# Altium project mV_Meter.PrjPcb (part 2 of 2)

## Sheet DISP_KEYB.SchDoc: Title
size 420 x 297 mm; Author: G.Kasprowicz; CompanyName: WUT ISE; DrawnBy: G.Kasprowicz; Organization: WUT ISE; Address1: PW ISE; Address2: Nowowiejska 15/19 00-665 Warsaw; Address3: gkasprow@gmail.com; Revision: 2; SheetNumber: 4; SheetTotal: 5; ModifiedBy: -; CheckedDate: -; Title2: Title 2; DivGrp: WUT ISE; Designer: G.Kasprowicz; ModifiedDate: -; ProjectName: Sensor Box
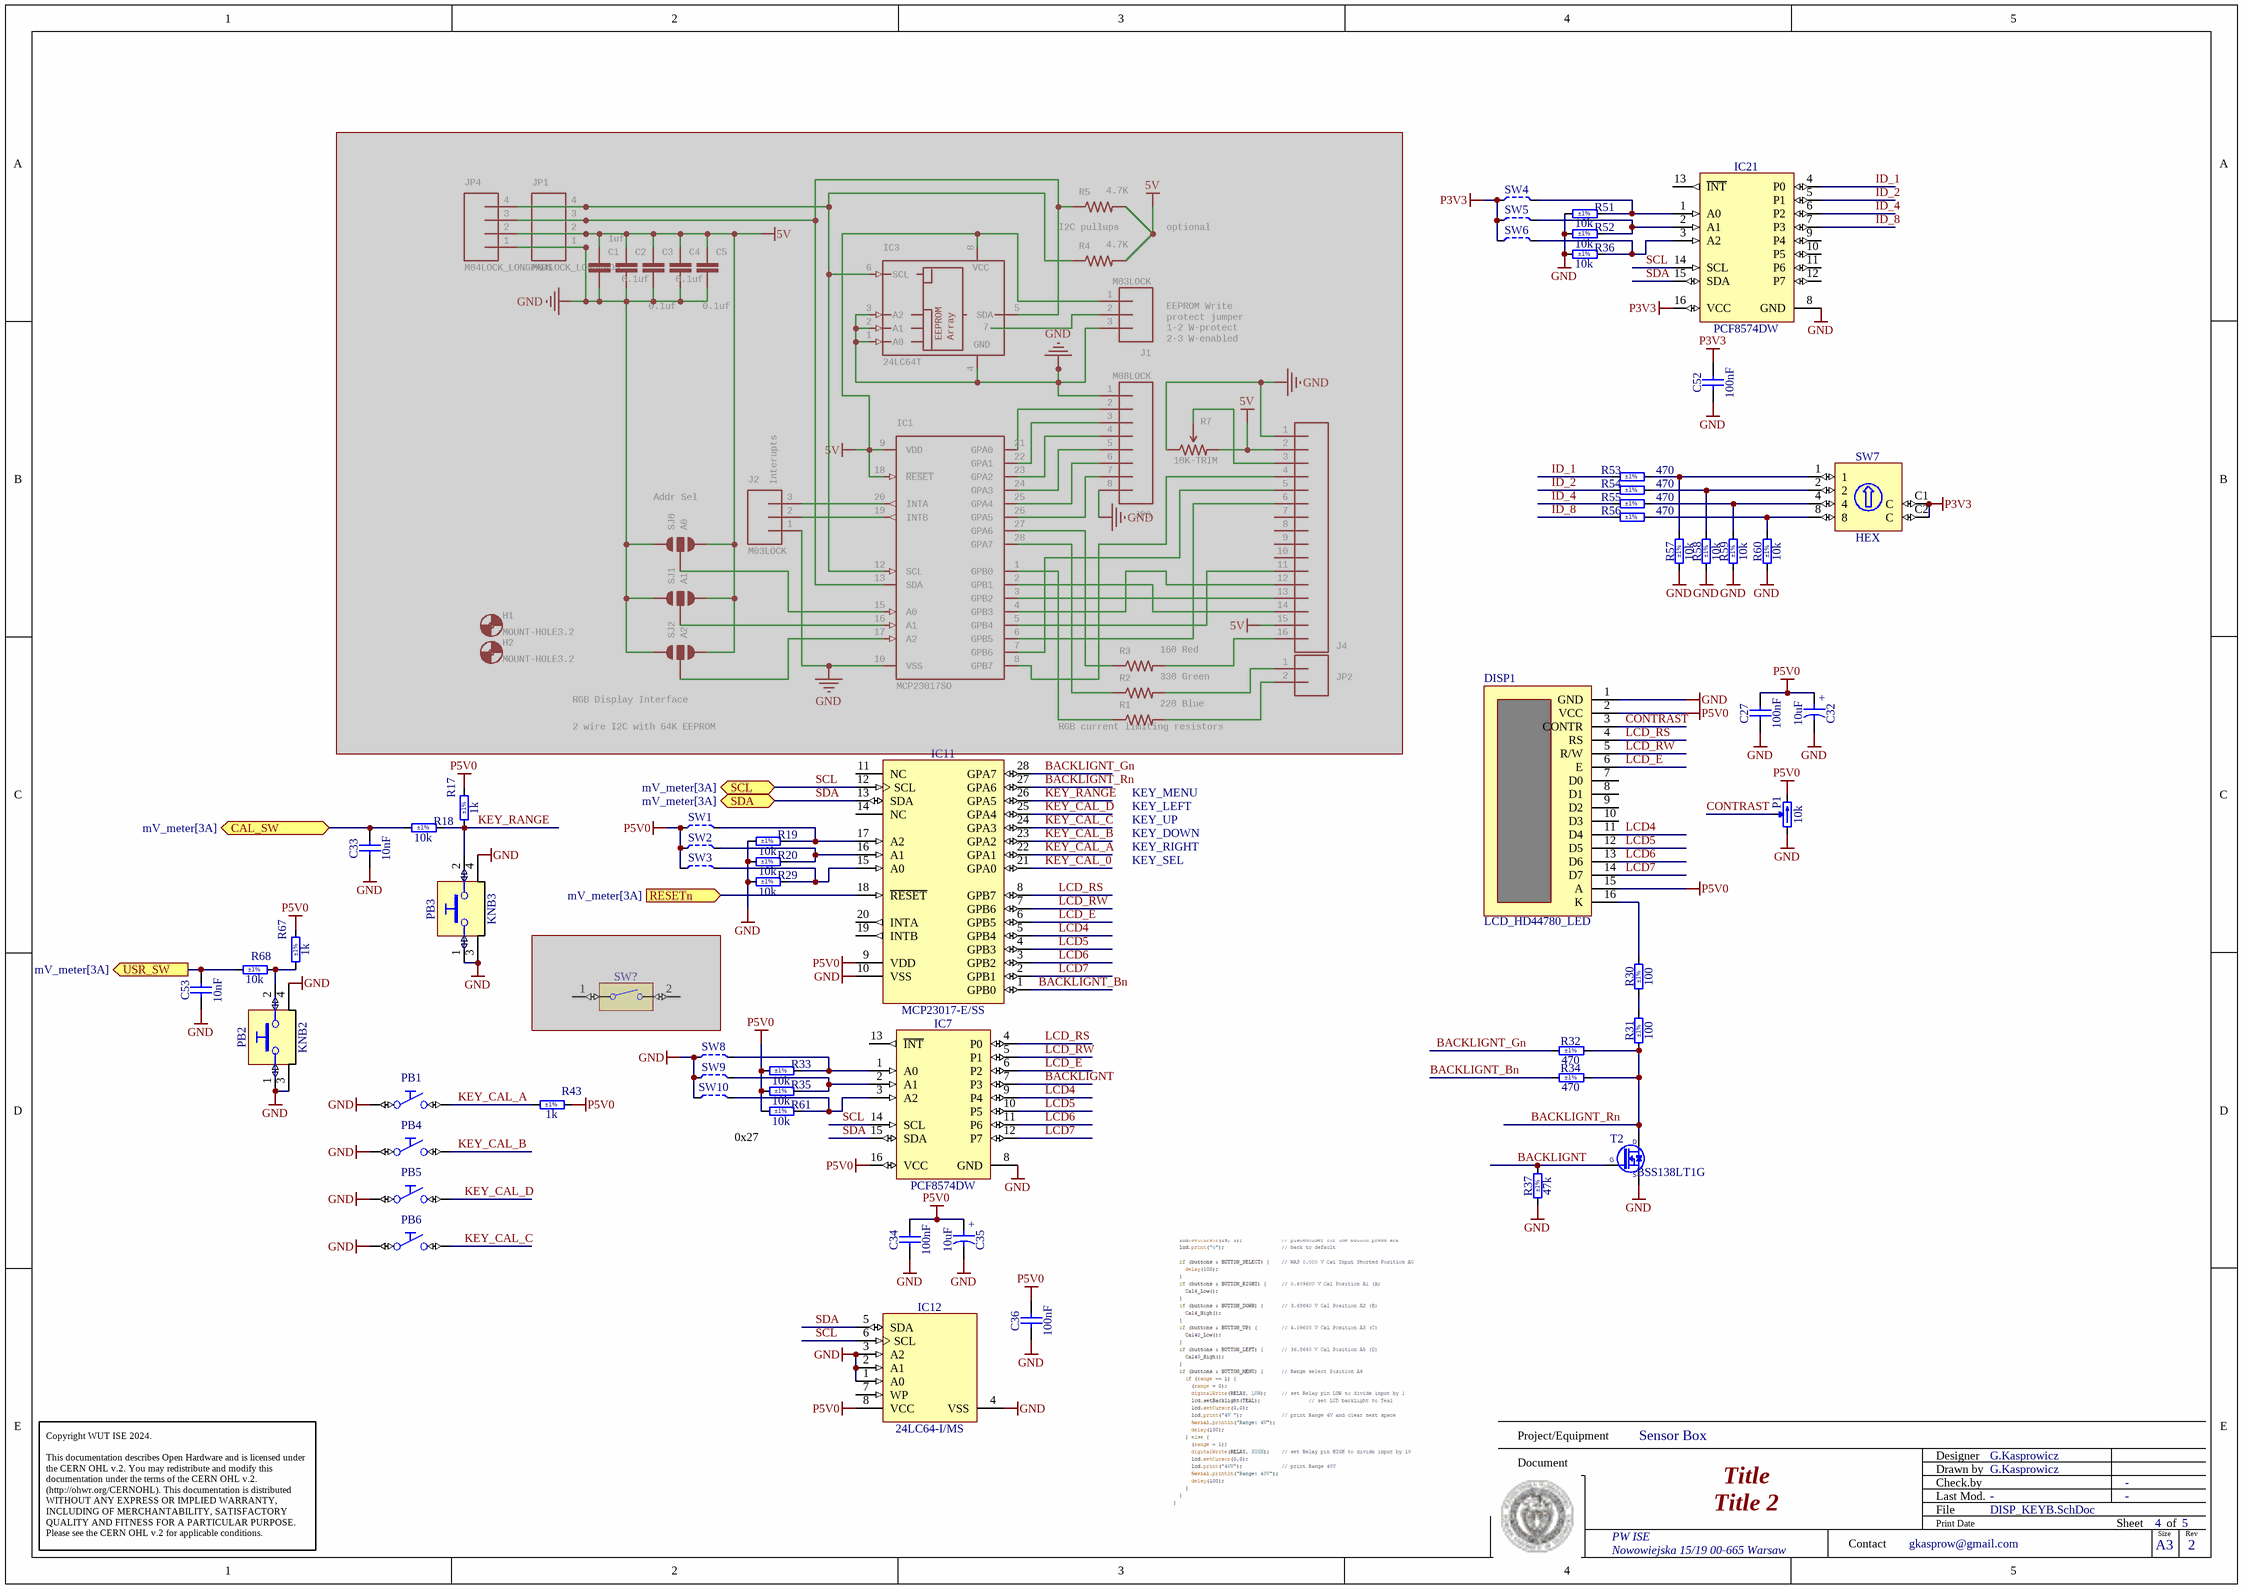
[diagram p3: DISP_KEYB.SchDoc]

### Parts
(Parts that share a designator on the sheet are numbered #1, #2 ... from top to bottom, then left to right.)
C1#1  1uf  [CAP-PTH-SMALLEZ]  (masked out: inside a compile mask, not in the netlist)
C2#1  0.1uf  [CAP-PTH-SMALLEZ]  (masked out: inside a compile mask, not in the netlist)
C3#1  0.1uf  [CAP-PTH-SMALLEZ]  (masked out: inside a compile mask, not in the netlist)
C4#1  0.1uf  [CAP-PTH-SMALLEZ]  (masked out: inside a compile mask, not in the netlist)
C5#1  0.1uf  [CAP-PTH-SMALLEZ]  (masked out: inside a compile mask, not in the netlist)
C27  100nF  [CAPC2012X88N]
C32  10uF  [CAPMP3216X180N]
C33  10nF  [CAPC1608X87N]
C34  100nF  [CAPC2012X88N]
C35  10uF  [CAPMP3216X180N]
C36  100nF  [CAPC2012X88N]
C52  100nF  [CAPC2012X88N]
C53  10nF  [CAPC1608X87N]
DISP1  LCD_HD44780_LED  [IDC_16_male]
H1  MOUNT-HOLE3.2  [3,2]  (masked out: inside a compile mask, not in the netlist)
H2  MOUNT-HOLE3.2  [3,2]  (masked out: inside a compile mask, not in the netlist)
IC1#1  MCP23017SO  [SO28W]  (masked out: inside a compile mask, not in the netlist)
IC3#2  24LC64T  [SO-08M]  (masked out: inside a compile mask, not in the netlist)
IC7  PCF8574DW  [SOIC127P1030X265-16N]
IC11  MCP23017-E/SS  [SOP65P780X200-28N]
IC12  24LC64-I/MS  [SOP65P490X110-8N]
IC21  PCF8574DW  [SOIC127P1030X265-16N]
J1#1  M03LOCK  [1X03_LOCK]  (masked out: inside a compile mask, not in the netlist)
J2#2  M03LOCK  [1X03_LOCK]  (masked out: inside a compile mask, not in the netlist)
J4#2  M16LOCK  [1X16_LOCK]  (value not drawn)  (masked out: inside a compile mask, not in the netlist)
JP1  M04LOCK_LONGPADS  [1X04_LOCK_LONGPADS]  (masked out: inside a compile mask, not in the netlist)
JP2  M02PTH  [1X02]  (value not drawn)  (masked out: inside a compile mask, not in the netlist)
JP3  M08LOCK  [1X08_LOCK]  (masked out: inside a compile mask, not in the netlist)
JP4  M04LOCK_LONGPADS  [1X04_LOCK_LONGPADS]  (masked out: inside a compile mask, not in the netlist)
KNB2  Knob  [KNB_OMRON_B32-2010_H]  (value not drawn)
KNB3  Knob  [KNB_OMRON_B32-2010_H]  (value not drawn)
P1  10k  [TRIM_BOURNS_3314G-1]
PB1  Push Button  [PB_C&K_KSS221GLFS]  (value not drawn)
PB2  Push Button  [PB_OMRON_B3F-3150]  (value not drawn)
PB3  Push Button  [PB_OMRON_B3F-3150]  (value not drawn)
PB4  Push Button  [PB_C&K_KSS221GLFS]  (value not drawn)
PB5  Push Button  [PB_C&K_KSS221GLFS]  (value not drawn)
PB6  Push Button  [PB_C&K_KSS221GLFS]  (value not drawn)
R1#1  220 Blue  [AXIAL-0.4]  (masked out: inside a compile mask, not in the netlist)
R2#1  330 Green  [AXIAL-0.4]  (masked out: inside a compile mask, not in the netlist)
R3#1  160 Red  [AXIAL-0.4]  (masked out: inside a compile mask, not in the netlist)
R4#1  4.7K  [AXIAL-0.3-KIT]  (masked out: inside a compile mask, not in the netlist)
R5#1  4.7K  [AXIAL-0.3-KIT]  (masked out: inside a compile mask, not in the netlist)
R7#2  10K-TRIM  [TRIMPOT_TC33]  (masked out: inside a compile mask, not in the netlist)
R17  1k  Tolerance: ±1%  [RESC1608X55N]
R18  10k  Tolerance: ±1%  [RESC1608X55N]
R19  10k  Tolerance: ±1%  [RESC1608X55N]
R20  10k  Tolerance: ±1%  [RESC1608X55N]
R29  10k  Tolerance: ±1%  [RESC1608X55N]
R30  100  Tolerance: ±1%  [RESC1608X55N]
R31  100  Tolerance: ±1%  [RESC1608X55N]
R32  470  Tolerance: ±1%  [RESC1608X55N]
R33  10k  Tolerance: ±1%  [RESC1608X55N]
R34  470  Tolerance: ±1%  [RESC1608X55N]
R35  10k  Tolerance: ±1%  [RESC1608X55N]
R36  10k  Tolerance: ±1%  [RESC1608X55N]
R37  47k  Tolerance: ±1%  [RESC1608X55N]
R43  1k  Tolerance: ±1%  [RESC1608X55N]
R51  10k  Tolerance: ±1%  [RESC1608X55N]
R52  10k  Tolerance: ±1%  [RESC1608X55N]
R53  470  Tolerance: ±1%  [RESC1608X55N]
R54  470  Tolerance: ±1%  [RESC1608X55N]
R55  470  Tolerance: ±1%  [RESC1608X55N]
R56  470  Tolerance: ±1%  [RESC1608X55N]
R57  10k  Tolerance: ±1%  [RESC1608X55N]
R58  10k  Tolerance: ±1%  [RESC1608X55N]
R59  10k  Tolerance: ±1%  [RESC1608X55N]
R60  10k  Tolerance: ±1%  [RESC1608X55N]
R61  10k  Tolerance: ±1%  [RESC1608X55N]
R67  1k  Tolerance: ±1%  [RESC1608X55N]
R68  10k  Tolerance: ±1%  [RESC1608X55N]
SJ0  A0  [SJ_3_PASTE2&3]  (masked out: inside a compile mask, not in the netlist)
SJ1  A1  [SJ_3_PASTE2&3]  (masked out: inside a compile mask, not in the netlist)
SJ2  A2  [SJ_3_PASTE2&3]  (masked out: inside a compile mask, not in the netlist)
SW1  Switch  [JUMPSMD0805_G50]  (value not drawn)  (no BOM)
SW2  Switch  [JUMPSMD0805_G50]  (value not drawn)  (no BOM)
SW3  Switch  [JUMPSMD0805_G50]  (value not drawn)  (no BOM)
SW4  Switch  [JUMPSMD0805_G50]  (value not drawn)  (no BOM)
SW5  Switch  [JUMPSMD0805_G50]  (value not drawn)  (no BOM)
SW6  Switch  [JUMPSMD0805_G50]  (value not drawn)  (no BOM)
SW7  HEX  [SW_APEM_PT65106L254]
SW8  Switch  [JUMPSMD0805_G50]  (value not drawn)  (no BOM)
SW9  Switch  [JUMPSMD0805_G50]  (value not drawn)  (no BOM)
SW10  Switch  [JUMPSMD0805_G50]  (value not drawn)  (no BOM)
SW?  Switch  [SW_OMRON_B3U-3000PM]  (value not drawn)  (masked out: inside a compile mask, not in the netlist)
T2  BSS138LT1G  [SOT95P240X110-3N]

### Ports
CAL_SW (bidir, see mV_meter[3A]), RESETn (in, see mV_meter[3A]), SCL (bidir, see mV_meter[3A]), SDA (bidir, see mV_meter[3A]), USR_SW (out, see mV_meter[3A])

### Nets
GND: C27.1 C32.2 C33.1 C34.1 C35.2 C36.1 C52.1 C53.1 DISP1.1(GND) IC7.8(GND) IC11.10(VSS) IC12.1(A0) IC12.2(A1) IC12.3(A2) IC12.4(VSS) IC21.8(GND) P1.1(CCW) PB1.1(C) PB2.1 PB2.3 PB2.4 PB3.1 PB3.3 PB3.4 PB4.1(C) PB5.1(C) PB6.1(C) R19.1 R20.1 R29.1 R36.1 R37.1 R51.1 R52.1 R57.1 R58.1 R59.1 R60.1 SW8.1 SW9.1 SW10.1 T2.2(S)
P3V3: C52.2 IC21.16(VCC) SW4.1 SW5.1 SW6.1 SW7.C1(C) SW7.C2(C)
P5V0: C27.2 C32.1 C34.2 C35.1 C36.2 DISP1.2(VCC) DISP1.15(A) IC7.16(VCC) IC11.9(VDD) IC12.8(VCC) P1.3(CW) R17.2 R33.1 R35.1 R43.2 R61.1 R67.2 SW1.1 SW2.1 SW3.1
BACKLIGNT: IC7.7(P3) R37.2 T2.1(G)
BACKLIGNT_Bn: IC11.1(GPB0) R34.1
BACKLIGNT_Gn: IC11.28(GPA7) R32.1
BACKLIGNT_Rn: IC11.27(GPA6) R31.1 R32.2 R34.2 T2.3(D)
CAL_SW: C33.2 R18.1 ; port CAL_SW
CONTRAST: DISP1.3(CONTR) P1.2(W)
ID_1: IC21.4(P0) R53.1
ID_2: IC21.5(P1) R54.1
ID_4: IC21.6(P2) R55.1
ID_8: IC21.7(P3) R56.1
KEY_CAL_0: IC11.21(GPA0)
KEY_CAL_A: IC11.22(GPA1) PB1.2(NO) R43.1
KEY_CAL_B: IC11.23(GPA2) PB4.2(NO)
KEY_CAL_C: IC11.24(GPA3) PB6.2(NO)
KEY_CAL_D: IC11.25(GPA4) PB5.2(NO)
KEY_RANGE: IC11.26(GPA5) PB3.2 R17.1 R18.2
LCD4: DISP1.11(D4) IC7.9(P4) IC11.5(GPB4)
LCD5: DISP1.12(D5) IC7.10(P5) IC11.4(GPB3)
LCD6: DISP1.13(D6) IC7.11(P6) IC11.3(GPB2)
LCD7: DISP1.14(D7) IC7.12(P7) IC11.2(GPB1)
LCD_E: DISP1.6(E) IC7.6(P2) IC11.6(GPB5)
LCD_RS: DISP1.4(RS) IC7.4(P0) IC11.8(GPB7)
LCD_RW: DISP1.5(R/W) IC7.5(P1) IC11.7(GPB6)
RESETn: IC11.18(~{RESET}) ; port RESETn
SCL: IC7.14(SCL) IC11.12(SCL) IC12.6(SCL) IC21.14(SCL) ; port SCL
SDA: IC7.15(SDA) IC11.13(SDA) IC12.5(SDA) IC21.15(SDA) ; port SDA
USR_SW: C53.2 R68.1 ; port USR_SW
NetDISP1_16: DISP1.16(K) R30.2
NetIC7_1: IC7.1(A0) R33.2 SW8.2
NetIC7_2: IC7.2(A1) R35.2 SW9.2
NetIC7_3: IC7.3(A2) R61.2 SW10.2
NetIC11_15: IC11.15(A0) R29.2 SW3.2
NetIC11_16: IC11.16(A1) R20.2 SW2.2
NetIC11_17: IC11.17(A2) R19.2 SW1.2
NetIC21_1: IC21.1(A0) R51.2 SW4.2
NetIC21_2: IC21.2(A1) R52.2 SW5.2
NetIC21_3: IC21.3(A2) R36.2 SW6.2
NetPB2_2: PB2.2 R67.1 R68.2
NetR30_1: R30.1 R31.2
NetR53_2: R53.2 R57.2 SW7.1
NetR54_2: R54.2 R58.2 SW7.2
NetR55_2: R55.2 R59.2 SW7.4
NetR56_2: R56.2 R60.2 SW7.8

Not connected (* = marked no-connect by the designer): DISP1 7(D0) 8(D1) 9(D2) 10(D3); IC7 13(~{INT}); IC11 11(NC) 14(NC) 19(INTB) 20(INTA); IC12 7(WP); IC21 9(P4) 10(P5) 11(P6) 12(P7) 13(~{INT})

### Notes on the sheet
- I2C pullups
- optional
- (near IC3#2) 7
- (near J1#1) EEPROM Write
  protect jumper
  1-2 W-protect
  2-3 W-enabled
- (near SJ0) Addr Sel
- (near J2#2) Interupts
- (near SJ2) RGB Display Interface
- 2 wire I2C with 64K EEPROM
- (near R1#1) RGB current limiting resistors
- KEY_MENU
- KEY_LEFT
- KEY_UP
- KEY_DOWN
- KEY_RIGHT
- KEY_SEL
- 0x27
- Project/Equipment
- Document
- Designer
- Drawn by
- Check.by
- Copyright WUT ISE 2024.
  This documentation describes Open Hardware and is licensed under the CERN OHL v.2. You may redistribute and modify this documentation under the terms of the CERN OHL v.2. (http://ohwr.org/CERNOHL). This documentation is distributed WITHOUT ANY EXPRESS OR IMPLIED WARRANTY, INCLUDING OF MERCHANTABILITY, SATISFACTORY QUALITY AND FITNESS FOR A PARTICULAR PURPOSE. Please see the CERN OHL v.2 for applicable conditions.
- Contact
- File
- Last Mod.
- Print Date
- Sheet
- Size
- A3
- of
- Rev
- (in symbol CTE3216-18_10UF_10V_10%_LESR1800) +

### Library data of the parts
C1#1 C2#1 C3#1 C4#1 C5#1 = CAPEZ: CapacitorStandard 0603 ceramic capacitor, and 0.1" leaded capacitor.; GateName_1: G$1; SymbolName_1: CAP; DeviceName: EZ; LibraryName: SparkFun-Capacitors; DeviceSetName: CAP
C27 C34 C36 C52 = CC0805_100NF_50V_1%_NP0: Non-polarised capacitor; Part Description: SMD Multilayer Chip Ceramic Capacitor; Manufacturer: GENERIC; Manufacturer1 Part Number: 0805N103F500C; Voltage: 50V; TC: C0G/NP0; Tolerance: ±1%; Part Number: CC0805_100NF_50V_1%_NP0; Component Kind: Standard; Component Type: Standard; Footprint: CAPC2012X135N; Pin Count: 2; Value: 100nF; Status: Not Recommended; Manufacturer Part Number: CC0805_100NF_50V_1%_NP0; Case: 0805; Mounted: Yes; Socket: No; SMD: Yes; Sense: No; ComponentHeight: 1.35mm; Manufacturer1 Example: WALSIN TECHNOLOGY CORPORATION; Manufacturer1 ComponentHeight: 1.35mm; HelpURL: \\cern.ch\dfs\Applications\Altium\Datasheets\CC0805_WALSIN_0805.pdf; Author: CERN DEM HF; CreateDate: 28.08.2023; LatestRevisionDate: 28.08.2023
C32 C35 = CTE3216-18_10UF_10V_10%_LESR1800: Polarised capacitor; Part Description: Low ESR 1R8 Solid Tantalum Chip Capacitor; Manufacturer: GENERIC; Manufacturer1 Part Number: TPSA106K010R1800; Voltage: 10V; Tolerance: ±10%; Part Number: CTE3216-18_10UF_10V_10%_LESR1800; Component Kind: Standard; Component Type: Standard; Pin Count: 2; Value: 10uF; Status: Preferred; Manufacturer Part Number: CTE3216-18_10UF_10V_10%_LESR1800; Case: A; Mounted: Yes; Socket: No; SMD: Yes; Sense: No; Manufacturer1 Example: AVX; Manufacturer1 ComponentHeight: 1.8mm; HelpURL: \\cern.ch\dfs\Applications\Altium\Datasheets\CTE-LESR_AVX_TPS.pdf; Author: CERN DEM JLC; CreateDate: 05.05.2008; LatestRevisionDate: 20.01.2009
C33 C53 = CC0603_10NF_50V_5%_C0G: Non-polarised capacitor; Part Description: SMD Multilayer Chip Ceramic Capacitor; Manufacturer: GENERIC; Manufacturer1 Part Number: C1608C0G1H103J080; Voltage: 50V; TC: C0G/NP0; Tolerance: ±5%; Part Number: CC0603_10NF_50V_5%_C0G; Component Kind: Standard; Component Type: Standard; Pin Count: 2; Value: 10nF; Status: Preferred; Manufacturer Part Number: CC0603_10NF_50V_5%_C0G; Case: 0603; Mounted: Yes; Socket: No; SMD: Yes; Sense: No; Manufacturer1 Example: TDK; Manufacturer1 ComponentHeight: 0.9mm; HelpURL: \\cern.ch\dfs\Applications\Altium\Datasheets\CC0603_C0G_TDK_C.pdf; Author: CERN DEM JLC; CreateDate: 10.12.2014; LatestRevisionDate: 10.12.2014
DISP1 = LCD_HD44780_LED: LCD character display socket with backlight
H1 H2 = MOUNT-HOLE3.2: MOUNTING HOLE with drill center marker; GateName_1: G$1; DeviceName: 3.2; SymbolName_1: MOUNT-HOLE; LibraryName: holes; DeviceSetName: MOUNT-HOLE
IC1#1 = MCP23017SO: http://ww1.microchip.com/downloads/en/DeviceDoc/21952a.pdf   Source: http://ww1.microchip.com/downloads/en/DeviceDoc/21952a.pdf; GateName_1: G$1; DeviceName: SO; SymbolName_1: MCP23017; LibraryName: adafruit; DeviceSetName: MCP23017
IC3#2 = 24-*SM: Serial EEPROM   32 K/64 K, 1.8 V, I2C; MPN: 24LC65/SM; GateName_1: G$1; SymbolName_1: 24AA32; DeviceName: SM; DeviceSetName: 24-*; MF: MICROCHIP; LibraryName: microchip; Array: Array; VCC: VCC; GND: GND; EEPROM: EEPROM; OC_FARNELL: 9758097; OC_NEWARK: 96K4082
IC7 IC21 = PCF8574DW: Remote 8-bit I/O Expander For I2C Bus; Manufacturer: TEXAS INSTRUMENTS; PressFit: No; Bonding: No; Part Number: PCF8574DW; Component Kind: Standard; Component Type: Standard; Device: PCF8574DW; PackageDescription: SOIC, 1.27mm Pitch; 16 Pin, 7.50mm W X 10.3mm L X 2.65mm H body, IPC Medium Density; Part Description: Remote 8-bit I/O Expander for I2C Bus; Manufacturer Part Number: PCF8574DW; Pin Count: 16; Case: SOIC16W; Mounted: Yes; Socket: No; SMD: Yes; Sense: No; ComponentHeight: 2.65mm; Author: CERN DEM JLC; HelpURL: \\cern.ch\dfs\Applications\Altium\Datasheets\PCF8574DW.pdf; CreateDate: 25.08.2011; LatestRevisionDate: 25.08.2011
IC11 = MCP23017-E/SS: 16-bit I/O Port Expander With Serial Interface; Manufacturer: MICROCHIP TECHNOLOGY; PressFit: No; Bonding: No; Part Number: MCP23017-E/SS; Component Kind: Standard; Component Type: Standard; Device: MCP23017-E/SS; PackageDescription: SOP, 0.65mm Pitch; 28 Pin, 5.30mm W X 10.20mm L X 2.00mm H Body, IPC Medium Density; Part Description: 16-bit I/O Port Expander with Serial Interface; Manufacturer Part Number: MCP23017-E/SS; Pin Count: 28; Case: SSOP28; Mounted: Yes; Socket: No; SMD: Yes; Sense: No; ComponentHeight: 2mm; Author: CERN DEM JLC; HelpURL: \\cern.ch\dfs\Applications\Altium\Datasheets\MCP23017-E-SS.pdf; CreateDate: 17.01.2011; LatestRevisionDate: 17.01.2011
IC12 = 24LC64-I/MS: 64K I2C Serial EEPROM; Part Description: 2.5V-5.5V, 64K (8K x 8-bit) I2C Serial EEPROM; Manufacturer: MICROCHIP TECHNOLOGY; PressFit: No; Bonding: No; Part Number: 24LC64-I/MS; Component Kind: Standard; Component Type: Standard; Device: 24LC64-I/MS; PackageDescription: SOP, 0.65mm pitch; 8 pin, 3.00mm W X 3.00mm L X 1.10mm H body, IPC Medium Density; Manufacturer Part Number: 24LC64-I/MS; Pin Count: 8; Case: MSOP8; Mounted: Yes; Socket: No; SMD: Yes; Sense: No; ComponentHeight: 1.1mm; HelpURL: \\cern.ch\dfs\Applications\Altium\Datasheets\24LC64-I-MS.pdf; Author: CERN DEM JLC; CreateDate: 24.01.2011; LatestRevisionDate: 24.01.2011
J1#1 J2#2 = M03LOCK: Header 3Standard 3-pin 0.1" header. Use with straight break away headers (SKU : PRT-00116), right angle break away headers (PRT-00553), swiss pins (PRT-00743), machine pins (PRT-00117), and female headers (PRT-00115). Molex polarized connector foot print use with SKU : PRT-08232 with associated crimp pins and housings.; GateName_1: J$1; SymbolName_1: M03; DeviceName: LOCK; LibraryName: SparkFun-Connectors; DeviceSetName: M03
J4#2 = M16LOCK: 1x16 .1" header; GateName_1: G$1; SymbolName_1: M16; DeviceName: LOCK; LibraryName: SparkFun-Connectors; DeviceSetName: M16
JP1 JP4 = M04LOCK_LONGPADS: Header 4Standard 4-pin 0.1" header. Use with straight break away headers (SKU : PRT-00116), right angle break away headers (PRT-00553), swiss pins (PRT-00743), machine pins (PRT-00117), and female headers (PRT-00115). Molex polarized connector foot print use with SKU : PRT-08231 with associated crimp pins and housings. 1MM SMD Version SKU: PRT-10208; GateName_1: G$1; SymbolName_1: M04; DeviceName: LOCK_LONGPADS; LibraryName: SparkFun-Connectors; DeviceSetName: M04
JP2 = M02PTH: Standard 2-pin 0.1" header. Use with  - straight break away headers ( PRT-00116) - right angle break away headers (PRT-00553) - swiss pins (PRT-00743) - machine pins (PRT-00117) - female headers (PRT-00115)   Molex polarized connector foot print use with: PRT-08233 with associated crimp pins and housings.  2.54_SCREWTERM for use with  PRT-10571.  3.5mm Screw Terminal footprints for  PRT-08084  5mm Screw Terminal footprints for use with PRT-08432; GateName_1: G$1; SymbolName_1: M02; DeviceName: PTH; LibraryName: SparkFun-Connectors; DeviceSetName: M02
JP3 = M08LOCK: Header 8Standard 8-pin 0.1" header. Use with straight break away headers (SKU : PRT-00116), right angle break away headers (PRT-00553), swiss pins (PRT-00743), machine pins (PRT-00117), and female headers (PRT-00115).; GateName_1: G$1; SymbolName_1: M08; DeviceName: LOCK; LibraryName: SparkFun-Connectors; DeviceSetName: M08
KNB2 KNB3 = KNB_OMRON_B32-2010_h: Knob For Push-Button Switch OMRON SERIE B32; Part Description: Black Knob For OMRON Push-Button Switch (Dia. 6mm L=5.5mm); PressFit: No; Part Number: KNB_OMRON_B32-2010_h; Component Kind: Accessories; Component Type: Mechanical; Pin Count: 0; PackageDescription: Black Knob For OMRON Push-Button Switch (Dia. 6mm L=5.5mm) Horizontal; Family: Knob; Mounted: Yes; Socket: No; SMD: No; Sense: No; Status: None; Manufacturer: OMRON; Manufacturer Part Number: B32-2010; ComponentHeight: 7mm; HelpURL: \\cern.ch\dfs\Applications\Altium\Datasheets\KNB_OMRON_B32-2010.pdf; Author: CERN DEM HF; CreateDate: 13.05.2022; LatestRevisionDate: 13.05.2022
P1 = TRIM_1T_10K_BOURNS_3314G-1-103E: Trimming Potentiometer; Part Description: Single Turn 4mm Square Trimpot® Trimming Potentiometer (Top Adjust); Manufacturer: BOURNS; Power: 0.25W; TC: ±100ppm/°C; Tolerance: ±20%; PressFit: No; Part Number: TRIM_1T_10K_BOURNS_3314G-1-103E; Component Kind: Standard; Component Type: Standard; Pin Count: 3; Value: 10k; Manufacturer Part Number: 3314G-1-103E; Case: 3314G-1; Mounted: Yes; Socket: No; SMD: Yes; Sense: No; ComponentHeight: 2.55mm; HelpURL: \\cern.ch\dfs\Applications\Altium\Datasheets\TRIM_BOURNS_3314G-1.pdf; Author: CERN DEM JLC; CreateDate: 04.03.2014; LatestRevisionDate: 04.03.2014
PB1 PB4-PB6 = PB_C&K_KSS221GLFS: Push-Button Switch SPST; Part Description: 32VDC 50mA SPST-NO Surface Mount Subminiature Tact Momentary Side Actuated Pushbutton Switch, Operating Force 2N; Manufacturer: C&K; PressFit: No; Sense Comment: Non-washable; Part Number: PB_C&K_KSS221GLFS; Component Kind: Standard; Component Type: Standard; Pin Count: 2; PackageDescription: Body 7.0x3.5mm, Surface Mount Subminiature Tact Side Actuated Switch, C&K KSS Series; Family: Push Button; Mounted: Yes; Socket: No; SMD: Yes; Sense: Yes; Status: None; Manufacturer Part Number: KSS221GLFS; ComponentHeight: 1.7mm; HelpURL: \\cern.ch\dfs\Applications\Altium\Datasheets\PB_C&K_KSS221GLFS.pdf; Author: CERN DEM BC; CreateDate: 02.12.2019; LatestRevisionDate: 02.12.2019
PB2 PB3 = PB_OMRON_B3F-3150: Push-Button Switch SPST; Part Description: 24VDC 50mA SPST-NO Tactile Push-Button Switch, Side-operated (h=7.4mm); Manufacturer: OMRON; PressFit: No; Part Number: PB_OMRON_B3F-3150; Component Kind: Standard; Component Type: Standard; Pin Count: 4; PackageDescription: 7.3x6.25mm Model, Side-operated , Projected Plunger Type (without Ground Terminal) Pushbutton Switch, OMRON B3F Series; Family: Push Button; Mounted: Yes; Socket: No; SMD: No; Sense: No; Status: None; Manufacturer Part Number: B3F-3150; ComponentHeight: 7.4mm; HelpURL: \\cern.ch\dfs\Applications\Altium\Datasheets\PB_OMRON_B3F-3150.pdf; Author: CERN DEM HF; CreateDate: 13.05.2022; LatestRevisionDate: 13.05.2022
R1#1 R2#1 R3#1 = RESISTORPTH-1/4W: ResistorBasic schematic elements and footprints for 0603, 1206, and PTH resistors.; GateName_1: G$1; SymbolName_1: RESISTOR; DeviceName: PTH-1/4W; LibraryName: SparkFun-Resistors; DeviceSetName: RESISTOR
R4#1 R5#1 = RESISTORKIT: ResistorBasic schematic elements and footprints for 0603, 1206, and PTH resistors.; GateName_1: G$1; DeviceName: KIT; SymbolName_1: RESISTOR; LibraryName: SparkFun-Resistors; DeviceSetName: RESISTOR
R7#2 = TRIMPOT-2: Various small potentiometers for "set-and-forget" applications; GateName_1: R?; SymbolName_1: TRIMPOT-1; DeviceName: -2; LibraryName: SparkFun-Electromechanical; DeviceSetName: TRIMPOT
R17 R43 R67 = R0603_1K_1%_0.1W_100PPM: Resistor - 1%; Part Description: General Purpose Thick Film Chip Resistor; Manufacturer: GENERIC; Manufacturer1 Part Number: NRC06F1001TRF; Power: 0.1W; TC: ±100ppm/°C; PressFit: No; Part Number: R0603_1K_1%_0.1W_100PPM; Component Kind: Standard; Component Type: Standard; Pin Count: 2; Value: 1k; Status: Preferred; Manufacturer Part Number: R0603_1K_1%_0.1W_100PPM; Case: 0603; Mounted: Yes; Sense: No; Socket: No; SMD: Yes; Manufacturer1 Example: NIC COMPONENT; Manufacturer1 ComponentHeight: 0.55mm; HelpURL: \\cern.ch\dfs\Applications\Altium\Datasheets\R0603_NIC_NRC.pdf; Author: CERN DEM JLC; CreateDate: 03.12.2007; LatestRevisionDate: 13.03.2008
R18-R20 R29 R33 R35 R36 R51 R52 R57-R61 R68 = R0603_10K_1%_0.1W_100PPM: Resistor - 1%; Part Description: General Purpose Thick Film Chip Resistor; Manufacturer: GENERIC; Manufacturer1 Part Number: NRC06F1002TRF; Power: 0.1W; TC: ±100ppm/°C; PressFit: No; Part Number: R0603_10K_1%_0.1W_100PPM; Component Kind: Standard; Component Type: Standard; Pin Count: 2; Value: 10k; Status: Preferred; Manufacturer Part Number: R0603_10K_1%_0.1W_100PPM; Case: 0603; Mounted: Yes; Sense: No; Socket: No; SMD: Yes; Manufacturer1 Example: NIC COMPONENT; Manufacturer1 ComponentHeight: 0.55mm; HelpURL: \\cern.ch\dfs\Applications\Altium\Datasheets\R0603_NIC_NRC.pdf; Author: CERN DEM JLC; CreateDate: 03.12.2007; LatestRevisionDate: 13.03.2008
R30 R31 = R0603_100R_1%_0.1W_100PPM: Resistor - 1%; Part Description: General Purpose Thick Film Chip Resistor; Manufacturer: GENERIC; Manufacturer1 Part Number: NRC06F4700TRF; Power: 0.1W; TC: ±100ppm/°C; PressFit: No; Part Number: R0603_100R_1%_0.1W_100PPM; Component Kind: Standard; Component Type: Standard; Pin Count: 2; Value: 100; Status: Preferred; Manufacturer Part Number: R0603_100R_1%_0.1W_100PPM; Case: 0603; Mounted: Yes; Sense: No; Socket: No; SMD: Yes; Manufacturer1 Example: NIC COMPONENT; Manufacturer1 ComponentHeight: 0.55mm; HelpURL: \\cern.ch\dfs\Applications\Altium\Datasheets\R0603_NIC_NRC.pdf; Author: CERN DEM JLC; CreateDate: 03.12.2007; LatestRevisionDate: 13.03.2008
R32 R34 R53-R56 = R0603_470R_1%_0.1W_100PPM: Resistor - 1%; Part Description: General Purpose Thick Film Chip Resistor; Manufacturer: GENERIC; Manufacturer1 Part Number: NRC06F4700TRF; Power: 0.1W; TC: ±100ppm/°C; PressFit: No; Part Number: R0603_470R_1%_0.1W_100PPM; Component Kind: Standard; Component Type: Standard; Pin Count: 2; Value: 470; Status: Preferred; Manufacturer Part Number: R0603_470R_1%_0.1W_100PPM; Case: 0603; Mounted: Yes; Sense: No; Socket: No; SMD: Yes; Manufacturer1 Example: NIC COMPONENT; Manufacturer1 ComponentHeight: 0.55mm; HelpURL: \\cern.ch\dfs\Applications\Altium\Datasheets\R0603_NIC_NRC.pdf; Author: CERN DEM JLC; CreateDate: 03.12.2007; LatestRevisionDate: 13.03.2008
R37 = R0603_47K_1%_0.1W_100PPM: Resistor - 1%; Part Description: General Purpose Thick Film Chip Resistor; Manufacturer: GENERIC; Manufacturer1 Part Number: NRC06F4702TRF; Power: 0.1W; TC: ±100ppm/°C; PressFit: No; Part Number: R0603_47K_1%_0.1W_100PPM; Component Kind: Standard; Component Type: Standard; Pin Count: 2; Value: 47k; Status: Preferred; Manufacturer Part Number: R0603_47K_1%_0.1W_100PPM; Case: 0603; Mounted: Yes; Sense: No; Socket: No; SMD: Yes; Manufacturer1 Example: NIC COMPONENT; Manufacturer1 ComponentHeight: 0.55mm; HelpURL: \\cern.ch\dfs\Applications\Altium\Datasheets\R0603_NIC_NRC.pdf; Author: CERN DEM JLC; CreateDate: 03.12.2007; LatestRevisionDate: 13.03.2008
SJ0-SJ2 = SOLDERJUMPER_2WAYPASTE2&3: Solder Jumper2 way solder jumper; GateName_1: G$1; SymbolName_1: SJ_2; DeviceName: PASTE2&3; LibraryName: SparkFun-Passives; DeviceSetName: SOLDERJUMPER_2WAY
SW1-SW6 SW8-SW10 = JUMPSMD0805_G50: 2 SMD Pads for Bound by Solder  Drop; Part Description: 2 SMD Pads for Bound by Solder Drop - Equivalent Size 0805 - Gap 0.5mm; Manufacturer: None; Mounted: No; PressFit: No; Part Number: JUMPSMD0805_G50; Component Type: Standard (No BOM); Pin Count: 2; PackageDescription: 2 SMD Pads for Bound by Solder Drop - Equivalent Size 0805 - Gap 0.5mm; Family: Switch; Socket: No; SMD: No; Sense: No; Status: None; Manufacturer Part Number: None; ComponentHeight: 0mm; HelpURL: None; Author: CERN DEM JLC; CreateDate: 26.08.2009; LatestRevisionDate: 12.02.2021
SW7 = SW_APEM_PT65106L254: Rotary Code Switch 1 2 4 8 C1 C2; Part Description: Rotary Hexadecimal Right Angled Switch, Screwdriver Actuator, Straight terminals; Manufacturer: APEM; PressFit: No; Part Number: SW_APEM_PT65106L254; Component Kind: Standard; Component Type: Standard; Pin Count: 6; PackageDescription: Body 10x10mm, Right Angled Rotary Hexadecimal Code Switch With Screwdriver Actuator, APEM PT65 (CR65) Series; Family: HEX; Mounted: Yes; Socket: No; SMD: No; Sense: No; Status: None; Manufacturer Part Number: PT65106L254; ComponentHeight: 10mm; HelpURL: \\cern.ch\dfs\Applications\Altium\Datasheets\SW_APEM_PT65106L254.pdf; Author: CERN DEM JLC; CreateDate: 18.06.2014; LatestRevisionDate: 18.06.2014
SW? = SW_OMRON_B3U-3000PM: 1 Ways SPST DIP Switch; Part Description: Ultra-small Surface-mounting Tactile Switche with High Contact Reliability, Side-actuated, Contact Rating 50mA 12VDC; Manufacturer: OMRON; PressFit: No; Sense Comment: Non-washable; Part Number: SW_OMRON_B3U-3000PM; Component Kind: Standard; Component Type: Standard; Pin Count: 2; PackageDescription: Body 3.2x4.0mm, SPST Surface-Mounting Tactile Switch with Side Actuator (B3U Series); Family: Switch; Mounted: Yes; Socket: No; SMD: Yes; Sense: Yes; Status: None; Manufacturer Part Number: B3U-3000PM; ComponentHeight: 1.35mm; HelpURL: \\cern.ch\dfs\Applications\Altium\Datasheets\SW_OMRON_B3U.pdf; Author: CERN DEM HF; CreateDate: 04.10.2022; LatestRevisionDate: 04.10.2022
T2 = BSS138LT1G: N-CHANNEL MOSFET WITH DIODE; Part Description: 50V, 200mA N-Channel Enhancement Mode Field-Effect Transistor; Manufacturer: ON SEMICONDUCTOR; PressFit: No; Bonding: No; Part Number: BSS138LT1G; Component Kind: Standard; Component Type: Standard; Device: BSS138LT1G; PackageDescription: SOT23, 0.95mm Pitch; 3 Pin, 1.40mm W X 3.00mm L X 1.10mm H body, IPC Medium Density; Manufacturer Part Number: BSS138L; Pin Count: 3; Case: SOT23-3; Mounted: Yes; Socket: No; SMD: Yes; Sense: No; ComponentHeight: 1.11mm; HelpURL: \\cern.ch\dfs\Applications\Altium\Datasheets\BSS138LT1G.pdf; Author: CERN DEM JLC; CreateDate: 23.03.2009; LatestRevisionDate: 25.05.2022

## Sheet MVM_AFE.SchDoc: Title
size 420 x 297 mm; Author: G.Kasprowicz; CompanyName: WUT ISE; DrawnBy: G.Kasprowicz; Organization: WUT ISE; Address1: PW ISE; Address2: Nowowiejska 15/19 00-665 Warsaw; Address3: gkasprow@gmail.com; Revision: 2; SheetNumber: 5; SheetTotal: 5; ModifiedBy: -; CheckedDate: -; Title2: Title 2; DivGrp: WUT ISE; Designer: G.Kasprowicz; ModifiedDate: -; ProjectName: Sensor Box
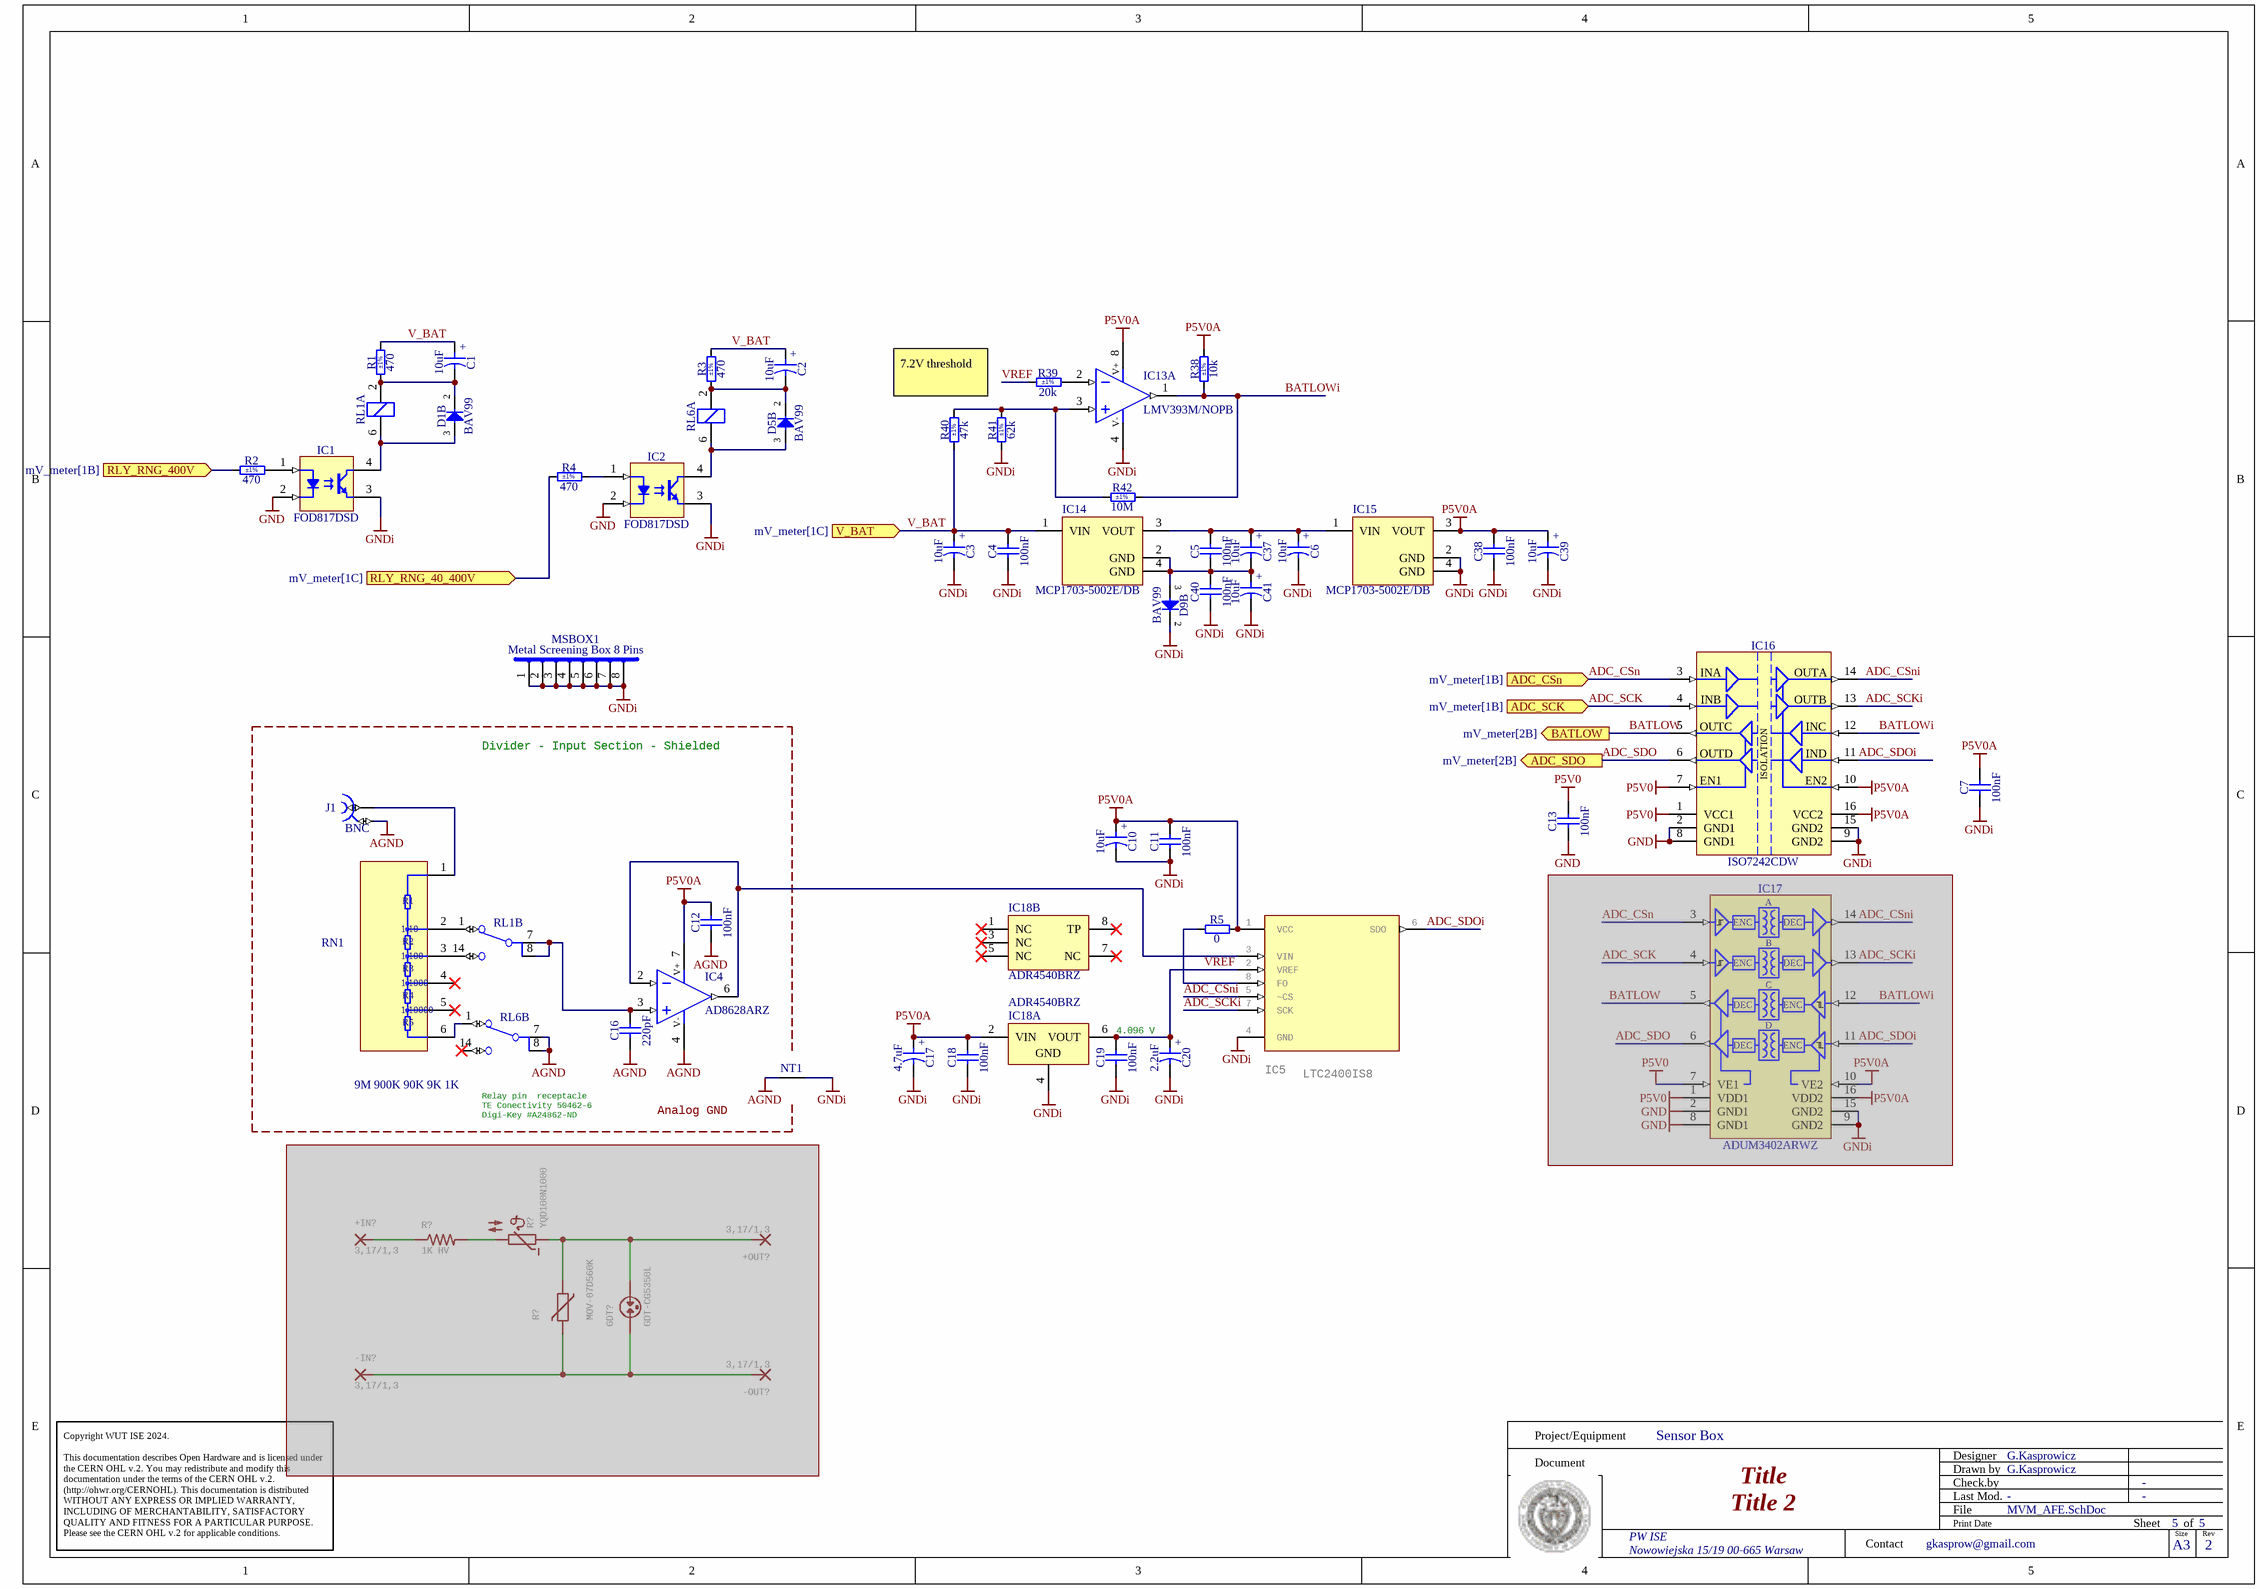
[diagram p4: MVM_AFE.SchDoc]

### Parts
(Parts that share a designator on the sheet are numbered #1, #2 ... from top to bottom, then left to right.)
+IN?  3,17/1,3  [3,17/1,3]  (masked out: inside a compile mask, not in the netlist)
+OUT?  3,17/1,3  [3,17/1,3]  (masked out: inside a compile mask, not in the netlist)
-IN?  3,17/1,3  [3,17/1,3]  (masked out: inside a compile mask, not in the netlist)
-OUT?  3,17/1,3  [3,17/1,3]  (masked out: inside a compile mask, not in the netlist)
C1#2  10uF  [CAPMP3216X180N]
C2#2  10uF  [CAPMP3216X180N]
C3#2  10uF  [CAPMP3216X180N]
C4#2  100nF  [CAPC2012X88N]
C5#2  100nF  [CAPC2012X88N]
C6  10uF  [CAPMP3216X180N]
C7  100nF  [CAPC2012X88N]
C10  10uF  [CAPMP3216X180N]
C11  100nF  [CAPC2012X88N]
C12  100nF  [CAPC2012X88N]
C13  100nF  [CAPC2012X88N]
C16  220pF  [CAPC2012X135N]
C17  4.7uF  [CAPMP3216X180N]
C18  100nF  [CAPC2012X88N]
C19  100nF  [CAPC2012X88N]
C20  2.2uF  [CAPMP3216X180N]
C37  10uF  [CAPMP3216X180N]
C38  100nF  [CAPC2012X88N]
C39  10uF  [CAPMP3216X180N]
C40  100nF  [CAPC2012X88N]
C41  10uF  [CAPMP3216X180N]
D1  BAV99  [SOT95P240X110-3N]  (part B of 2)
D5  BAV99  [SOT95P240X110-3N]  (part B of 2)
D9  BAV99  [SOT95P240X110-3N]  (part B of 2)
GDT?  GDT-CG5350L  [CG5350L]  (masked out: inside a compile mask, not in the netlist)
IC1#2  FOD817DSD  [FAIRCHILD_FOD817DSD]
IC2  FOD817DSD  [FAIRCHILD_FOD817DSD]
IC4  AD8628ARZ  [SOIC127P600X175-8N]
IC5  LTC2400IS8  [SOIC127P600X175-8N]
IC13  LMV393M/NOPB  [SOIC127P600X175-8N]  (part A of 2)
IC14  MCP1703-5002E/DB  [SOT-223-DB3_N]
IC15  MCP1703-5002E/DB  [SOT-223-DB3_N]
IC16  ISO7242CDW  [SOIC127P1030X265-16N]
IC17#2  ADUM3402ARWZ  [SOIC127P1032X265-16N]  (masked out: inside a compile mask, not in the netlist)
IC18  ADR4540BRZ  [ADI-R-8_M]  (parts A,B of 2)
J1#2  BNC  [TYCO_1-1337542-0]
MSBOX1  Metal Screening Box 8 Pins  [MSBOX_PERANCEA_PFL6T]
NT1  Net Tie  [Net Tie]  (value not drawn)  (net tie, no BOM)
R1#2  470  Tolerance: ±1%  [RESC2012X60N]
R2#2  470  Tolerance: ±1%  [RESC2012X60N]
R3#2  470  Tolerance: ±1%  [RESC2012X60N]
R4#2  470  Tolerance: ±1%  [RESC2012X60N]
R5#2  0  [RESC1608X55N]
R38  10k  Tolerance: ±1%  [RESC1608X55N]
R39  20k  Tolerance: ±1%  [RESC1608X55N]
R40  47k  Tolerance: ±1%  [RESC1608X55N]
R41  62k  Tolerance: ±1%  [RESC1608X55N]
R42  10M  Tolerance: ±1%  [RESC1608X55N]
R?#1  1K HV  [AXIAL-0.6]  (masked out: inside a compile mask, not in the netlist)
R?#2  YQD100N1000  [B57164]  (masked out: inside a compile mask, not in the netlist)
R?#3  MOV-07D560K  [S05K11]  (masked out: inside a compile mask, not in the netlist)
RL1  COMUS 3563.1231.051  [REL_LITTELFUSE_HE700]  (value not drawn)  (parts A,B of 2)
RL6  COMUS 3563.1231.051  [REL_LITTELFUSE_HE700]  (value not drawn)  (parts A,B of 2)
RN1  9M 900K 90K 9K 1K  [1776-C6815]

### Ports
ADC_CSn (in, see mV_meter[1B]), ADC_SCK (in, see mV_meter[1B]), ADC_SDO (out, see mV_meter[2B]), BATLOW (out, see mV_meter[2B]), RLY_RNG_40_400V (in, see mV_meter[1C]), RLY_RNG_400V (in, see mV_meter[1B]), V_BAT (in, see mV_meter[1C])

### Nets
AGND: C12.1 C16.1 IC4.4(V-) J1#2.2 NT1.1 RL6.7(C) RL6.8(C)
GND: C13.1 IC1#2.2(C) IC2.2(C) IC16.2(GND1) IC16.8(GND1)
GNDi: C3#2.2 C4#2.1 C6.2 C7.1 C10.2 C11.1 C17.2 C18.1 C19.1 C20.2 C38.1 C39.2 C40.1 C41.2 D9.2(C) IC1#2.3(E) IC2.3(E) IC5.4(GND) IC13.4(V-) IC15.2(GND) IC15.4(GND) IC16.9(GND2) IC16.15(GND2) IC18.4(GND) MSBOX1.1 MSBOX1.2 MSBOX1.3 MSBOX1.4 MSBOX1.5 MSBOX1.6 MSBOX1.7 MSBOX1.8 NT1.2 R41.1
P5V0: C13.2 IC16.1(VCC1) IC16.7(EN1)
P5V0A: C7.2 C10.1 C11.2 C12.2 C17.1 C18.2 C38.2 C39.1 IC4.7(V+) IC5.1(VCC) IC13.8(V+) IC15.3(VOUT) IC16.10(EN2) IC16.16(VCC2) IC18.2(VIN) R5#2.2 R38.2
ADC_CSn: IC16.3(INA) ; port ADC_CSn
ADC_CSni: IC5.5(~CS) IC16.14(OUTA)
ADC_SCK: IC16.4(INB) ; port ADC_SCK
ADC_SCKi: IC5.7(SCK) IC16.13(OUTB)
ADC_SDO: IC16.6(OUTD) ; port ADC_SDO
ADC_SDOi: IC5.6(SDO) IC16.11(IND)
BATLOW: IC16.5(OUTC) ; port BATLOW
BATLOWi: IC13.1(OUT) IC16.12(INC) R38.1 R42.2
RLY_RNG_40_400V: R4#2.1 ; port RLY_RNG_40_400V
RLY_RNG_400V: R2#2.1 ; port RLY_RNG_400V
V_BAT: C1#2.1 C2#2.1 C3#2.1 C4#2.2 IC14.1(VIN) R1#2.2 R3#2.2 R40.1 ; port V_BAT  [project net BAT+]
VREF: C19.2 C20.1 IC5.2(VREF) IC18.6(VOUT) R39.1
NetC1#2_2: C1#2.2 D1.2(C) R1#2.1 RL1.2
NetC2#2_2: C2#2.2 D5.2(C) R3#2.1 RL6.2
NetC5#2_1: C5#2.1 C37.2 C40.2 C41.1 D9.3(COMAC) IC14.2(GND) IC14.4(GND)
NetC5#2_2: C5#2.2 C6.1 C37.1 IC14.3(VOUT) IC15.1(VIN)
NetC16_2: C16.2 IC4.3(IN+) RL1.7(C) RL1.8(C)
NetD1_3: D1.3(COMAC) IC1#2.4(C) RL1.6
NetD5_3: D5.3(COMAC) IC2.4(C) RL6.6
NetIC1#2_1: IC1#2.1(A) R2#2.2
NetIC2_1: IC2.1(A) R4#2.2
NetIC4_2: IC4.2(IN-) IC4.6(OUT) IC5.3(VIN)
NetIC5_8: IC5.8(FO) R5#2.1
NetIC13_2: IC13.2(IN-) R39.2
NetIC13_3: IC13.3(IN+) R40.2 R41.2 R42.1
NetJ1#2_1: J1#2.1 RN1.1
NetRL1_1: RL1.1(NC) RN1.2
NetRL1_14: RL1.14(NO) RN1.3
NetRL6_1: RL6.1(NC) RN1.6

Not connected (* = marked no-connect by the designer): IC18 1(NC)* 3(NC)* 5(NC)* 7(NC)* 8(TP)*; RL6 14(NO)*; RN1 4* 5*

### Notes on the sheet
- 7.2V threshold
- Divider - Input Section - Shielded
- 4.096 V
- Relay pin  receptacle
  TE Conectivity 50462-6
  Digi-Key #A24862-ND
- Analog GND
- Project/Equipment
- Document
- Designer
- Drawn by
- Check.by
- Copyright WUT ISE 2024.
  This documentation describes Open Hardware and is licensed under the CERN OHL v.2. You may redistribute and modify this documentation under the terms of the CERN OHL v.2. (http://ohwr.org/CERNOHL). This documentation is distributed WITHOUT ANY EXPRESS OR IMPLIED WARRANTY, INCLUDING OF MERCHANTABILITY, SATISFACTORY QUALITY AND FITNESS FOR A PARTICULAR PURPOSE. Please see the CERN OHL v.2 for applicable conditions.
- Contact
- File
- Last Mod.
- Print Date
- Sheet
- Size
- A3
- of
- Rev
- (in symbol ADUM3402ARWZ_a) A; ENC; DEC; B; C; D
- (in symbol CTE3216-18_2.2UF_25V_10%) +
- (in symbol CTE3216-18_4.7UF_10V_10%_LESR1400) +
- (in symbol CTE3216-18_10UF_10V_10%_LESR1800) +
- (in symbol ISO7242CDW) ISOLATION
- (in symbol RN_9M_900k_90k_9k_1k_CADDOCK_1776-C6815) R1; 1/10; R2; 1/100; R3; 1/1000; R4; 1/10000; R5

### Library data of the parts
+IN? +OUT? -IN? -OUT? = 3,17/1,3: THROUGH-HOLE PAD; GateName_1: 1; SymbolName_1: PAD; LibraryName: wirepad; DeviceSetName: 3,17/1,3
C1#2 C2#2 C3#2 C6 C10 C37 C39 C41 = CTE3216-18_10UF_10V_10%_LESR1800: as C32 on sheet DISP_KEYB; Part Number: CTE3216-18_10UF_10V_10%_LESR1800; Component Kind: Standard; Component Type: Standard; Pin Count: 2; Value: 10uF; Status: Preferred; Manufacturer Part Number: CTE3216-18_10UF_10V_10%_LESR1800; Case: A; Mounted: Yes; Socket: No; SMD: Yes; Sense: No; Manufacturer1 Example: AVX; Manufacturer1 ComponentHeight: 1.8mm; HelpURL: \\cern.ch\dfs\Applications\Altium\Datasheets\CTE-LESR_AVX_TPS.pdf; Author: CERN DEM JLC; CreateDate: 05.05.2008; LatestRevisionDate: 20.01.2009
C4#2 C5#2 C7 C11-C13 C18 C19 C38 C40 = CC0805_100NF_50V_1%_NP0: as C27 on sheet DISP_KEYB; Part Number: CC0805_100NF_50V_1%_NP0; Component Kind: Standard; Component Type: Standard; Footprint: CAPC2012X135N; Pin Count: 2; Value: 100nF; Status: Not Recommended; Manufacturer Part Number: CC0805_100NF_50V_1%_NP0; Case: 0805; Mounted: Yes; Socket: No; SMD: Yes; Sense: No; ComponentHeight: 1.35mm; Manufacturer1 Example: WALSIN TECHNOLOGY CORPORATION; Manufacturer1 ComponentHeight: 1.35mm; HelpURL: \\cern.ch\dfs\Applications\Altium\Datasheets\CC0805_WALSIN_0805.pdf; Author: CERN DEM HF; CreateDate: 28.08.2023; LatestRevisionDate: 28.08.2023
C16 = CC0805_220PF_50V_5%_C0G: Non-polarised capacitor; Part Description: SMD Multilayer Chip Ceramic Capacitor; Manufacturer: GENERIC; Manufacturer1 Part Number: C0805C151J5GACTU; Voltage: 50V; TC: C0G/NP0; Tolerance: ±5%; Part Number: CC0805_220PF_50V_5%_C0G; Component Kind: Standard; Component Type: Standard; Pin Count: 2; Value: 220pF; Status: Preferred; Manufacturer Part Number: CC0805_220PF_50V_5%_C0G; Case: 0805; Mounted: Yes; Socket: No; SMD: Yes; Sense: No; Manufacturer1 Example: KEMET; Manufacturer1 ComponentHeight: 0.88mm; HelpURL: \\cern.ch\dfs\Applications\Altium\Datasheets\CC0805_C0G_KEMET_(Commercial Grade).pdf; Author: CERN DEM JLC; CreateDate: 03.12.2007; LatestRevisionDate: 22.04.2015
C17 = CTE3216-18_4.7UF_10V_10%_LESR1400: Polarised capacitor; Part Description: Low ESR 1R4 Solid Tantalum Chip Capacitor; Manufacturer: GENERIC; Manufacturer1 Part Number: TPSA475K010R1400; Voltage: 10V; Tolerance: ±10%; Part Number: CTE3216-18_4.7UF_10V_10%_LESR1400; Component Kind: Standard; Component Type: Standard; Pin Count: 2; Value: 4.7uF; Status: Preferred; Manufacturer Part Number: CTE3216-18_4.7UF_10V_10%_LESR1400; Case: A; Mounted: Yes; Socket: No; SMD: Yes; Sense: No; Manufacturer1 Example: AVX; Manufacturer1 ComponentHeight: 1.8mm; HelpURL: \\cern.ch\dfs\Applications\Altium\Datasheets\CTE-LESR_AVX_TPS.pdf; Author: CERN DEM JLC; CreateDate: 05.05.2008; LatestRevisionDate: 20.01.2009
C20 = CTE3216-18_2.2UF_25V_10%: Polarised capacitor; Part Description: Solid Tantalum Chip Capacitor; Manufacturer: GENERIC; Manufacturer1 Part Number: TAJA225K025R; Voltage: 25V; Tolerance: ±10%; Part Number: CTE3216-18_2.2UF_25V_10%; Component Kind: Standard; Component Type: Standard; Pin Count: 2; Value: 2.2uF; Status: Preferred; Manufacturer Part Number: CTE3216-18_2.2UF_25V_10%; Case: A; Mounted: Yes; Socket: No; SMD: Yes; Sense: No; Manufacturer1 Example: AVX; Manufacturer1 ComponentHeight: 1.8mm; HelpURL: \\cern.ch\dfs\Applications\Altium\Datasheets\CTE_AVX_TAJ.pdf; Author: CERN DEM JLC; CreateDate: 26.05.2008; LatestRevisionDate: 26.05.2008
D1 D5 D9 = BAV99: Serial Diode; Part Description: Dual Series Signal Diode; Manufacturer: FAIRCHILD SEMICONDUCTOR; Voltage: 70V; Power: 350mW; PressFit: No; Bonding: No; Part Number: BAV99; Component Kind: Standard; Component Type: Standard; Device: BAV99; PackageDescription: SOT, 0.95mm Pitch; 3 Pin, 1.40mm W X 3.00mm L X 1.10mm H body, IPC Medium Density; Manufacturer Part Number: BAV99; Pin Count: 3; Case: SOT23-3; Mounted: Yes; Socket: No; SMD: Yes; Sense: No; ComponentHeight: 1.1mm; HelpURL: \\cern.ch\dfs\Applications\Altium\Datasheets\BAV99.pdf; Author: CERN DEM JLC; CreateDate: 06.05.2008; LatestRevisionDate: 27.09.2012
GDT? = GDT-CG5350L: GAS DISCHARGE TUBE; GateName_1: G$1; SymbolName_1: GDT; DeviceSetName: GDT-; DeviceName: CG5350L; LibraryName: supressor
IC1#2 IC2 = FOD817DSD: Single Optocoupler; Part Description: 4-Pin High Operating Temperature Phototransistor Optocoupler; Manufacturer: FAIRCHILD SEMICONDUCTOR; PressFit: No; Bonding: No; Part Number: FOD817DSD; Component Kind: Standard; Component Type: Standard; Device: FOD817DSD; PackageDescription: SOIC, 2.54mm Pitch; 4 Pin, 6.50mm W X 4.60mm L X 4.60mm H body; Manufacturer Part Number: FOD817DSD; Pin Count: 4; Case: SOIC4; Mounted: Yes; Socket: No; SMD: Yes; Sense: No; ComponentHeight: 4.6mm; HelpURL: \\cern.ch\dfs\Applications\Altium\Datasheets\FOD817DSD.pdf; Author: CERN DEM JLC; CreateDate: 21.07.2014; LatestRevisionDate: 21.07.2014
IC4 = AD8628ARZ: Operational Amplifier; Part Description: Zero-Drift, Single-Supply, Rail-to-Rail Input/Output Operational Amplifier; Manufacturer: ANALOG DEVICES; PressFit: No; Bonding: No; Part Number: AD8628ARZ; Component Kind: Standard; Component Type: Standard; Device: AD8628ARZ; PackageDescription: SOIC 8, Pitch 1.27mm - Body 4x5mm, IPC Medium Density; Manufacturer Part Number: AD8628AR; Pin Count: 8; Case: SOIC8; Mounted: Yes; Socket: No; SMD: Yes; Sense: No; ComponentHeight: 1.75mm; Author: CERN DEM JMW; HelpURL: \\cern.ch\dfs\Applications\Altium\Datasheets\AD8628ARZ.pdf; CreateDate: 30.11.2009; LatestRevisionDate: 29.03.2022
IC5 = ADC_LTC2400IS8PBF: 24-Bit μPower / No Latency ∆ΣTM ADC in SO-8; Manufacturer: Analog Devices; MPN: LTC2400IS8#PBF; GateName_1: A; PartNumber: LTC2400IS8PBF; LibraryName: LTC_By_element14_Batch_1; DeviceSetName: LTC2400IS8PBF; OC_FARNELL: 1500953; OC_NEWARK: 56M5404; PACKAGE: SOIC-8; SUPPLIER: Linear Technology
IC13 = LMV393M/NOPB: Dual Operational Amplifier; Part Description: Dual General Purpose, Low Voltage, Tiny Pack Comparator; Manufacturer: TEXAS INSTRUMENTS; PressFit: No; Bonding: No; Part Number: LMV393M/NOPB; Component Kind: Standard; Component Type: Standard; Device: LMV393M/NOPB; PackageDescription: SOIC 8, Pitch 1.27mm - Body 4x5mm, IPC Medium Density; Manufacturer Part Number: LMV393M; Pin Count: 8; Case: SOIC8; Mounted: Yes; Socket: No; SMD: Yes; Sense: No; ComponentHeight: 1.75mm; Author: CERN DEM JLC; HelpURL: \\cern.ch\dfs\Applications\Altium\Datasheets\LMV393M-NOPB.pdf; CreateDate: 29.11.2012; LatestRevisionDate: 01.06.2022
IC14 IC15 = CMP-0136-00522-1: 250 mA, 16V, Low Quiescent Current LDO Regulator, 3-Pin SOT-223, Extended Temperature; PackageReference: SOT-223-DB3; PackageVersion: revBB, Aug-2009; DatasheetVersion: revD, Sep-2009; PackageDescription: 3-Lead Plastic Small Outline Transistor (DB) [SOT-223]
IC16 = ISO7242CDW: Quad Channel (Two Channels in Each Direction), 150Mbps, Digital Isolator; Part Description: Quad Channel (2/2 Channel Directionality), 25Mbps, Digital Isolator; Manufacturer: TEXAS INSTRUMENTS; PressFit: No; Bonding: No; Part Number: ISO7242CDW; Component Kind: Standard; Component Type: Standard; Device: ISO7242CDW; PackageDescription: SOIC, 1.27mm Pitch; 16 Pin, 7.50mm W X 10.3mm L X 2.65mm H body, IPC Medium Density; Manufacturer Part Number: ISO7242CDW; Pin Count: 16; Case: SOIC16W; Mounted: Yes; Socket: No; SMD: Yes; Sense: No; ComponentHeight: 2.65mm; Author: CERN DEM HF; HelpURL: \\cern.ch\dfs\Applications\Altium\Datasheets\ISO724XX.pdf; CreateDate: 25.10.2022; LatestRevisionDate: 25.10.2022
IC17#2 = ADUM3402ARWZ_a: Quad-Channel, Digital Isolators, Enhanced System-Level ESD Reliability; Manufacturer: ANALOG DEVICES; PressFit: No; Bonding: No; Part Number: ADUM3402ARWZ_a; Component Kind: Standard; Component Type: Standard; Device: ADUM3402ARWZ; PackageDescription: SOIC, 1.27mm Pitch; 16 pin, 7.50mm W X 10.4mm L X 2.65mm H body, IPC Medium Density; Part Description: Quad-Channel, Digital Isolators, Enhanced System-Level ESD Reliability; Manufacturer Part Number: ADUM3402ARW; Pin Count: 16; Case: SOIC16W; Mounted: Yes; Socket: No; SMD: Yes; Sense: No; ComponentHeight: 2.65mm; Author: CERN DEM JLC; HelpURL: \\cern.ch\dfs\Applications\Altium\Datasheets\ADUM3402ARWZ.pdf; CreateDate: 10.10.2011; LatestRevisionDate: 25.03.2022
IC18 = CMP-0784-00192-1: Ultralow Noise, High Accuracy Voltage Reference, 4.096 V Output, 3 to 15 V Supply, Industrial, 8-pin SOIC (R-8), Tube; Manufacturer: Analog Devices; Max V Supply (V): 15; Min V Supply (V): 3; Vout: 4.096V; Ref Out TC (ppm/C): 2; ComponentLink4URL: Product URL:http://www.analog.com/en/special-linear-functions/voltage-references/adr4540/products/product.html; Mounting Technology: Surface Mount; ComponentLink1Description: Manufacturer URL; PackageDescription: 8-Pin Standard Small Outline Package, Body 4.9 x 3.9 mm, Pitch 1.27 mm; ComponentLink2URL: http://www.analog.com/static/imported-files/data_sheets/ADR4520_4525_4530_4533_4540_4550.pdf; ComponentLink1URL: http://www.analog.com/en/index.html; DatasheetVersion: Rev. 0; ComponentLink4Description: URL Link1; Operating Temp Range: -40 to 125 degC; PartNumber: ADR4540BRZ; ComponentLink2Description: Datasheet; ComponentLink3URL: http://www.analog.com/static/imported-files/packages/PKG_PDF/SOIC_Narrow%20(R)/R_8.pdf; ComponentLink3Description: Package Specification; PackageVersion: 060506-A, 06/2006; Packing: Tube; PackageReference: R-8; Code_JEDEC: MS-012-AA
J1#2 = TYCO_1-1337542-0: Part Description: 50 Ohms  BNC Elbow PCB Socket with Mounting Posts; Manufacturer: TYCO ELECTRONICS; PressFit: No; Part Number: TYCO_1-1337542-0; Component Kind: Standard; Component Type: Standard; Pin Count: 2; Family: BNC; Mounted: Yes; Socket: No; SMD: No; Sense: No; Status: None; Manufacturer Part Number: 1-1337542-0; ComponentHeight: 13.16mm; HelpURL: \\cern.ch\dfs\Applications\Altium\Datasheets\TYCO_1-1337542-0.pdf; Author: CERN DEM JLC; CreateDate: 02.02.2012; LatestRevisionDate: 02.02.2012
MSBOX1 = MSBOX_PERANCEA_PFL6T: Part Description: Metal Screening Box, Internal dimensions L50 x W50 x H15mm, Overall Size 55x55x16mm (No 8 pins); Manufacturer Part Number: PFL6T; PressFit: No; Part Number: MSBOX_PERANCEA_PFL6T; Component Kind: Standard; Component Type: Standard; Pin Count: 8; PackageDescription: Metal Screening Box, Internal dimensions L50 x W50 x H15mm, Overall Size 55x55x16mm; Mounted: Yes; Socket: No; SMD: No; Sense: No; Status: None; Manufacturer: PERANCEA; ComponentHeight: 16mm; HelpURL: \\cern.ch\dfs\Applications\Altium\Datasheets\MSBOX_PERANCEA_PFL6T.pdf; Author: CERN DEM JLC; CreateDate: 08.12.2008; LatestRevisionDate: 08.12.2008
NT1 = Net Tie: Part Description: Net Tie (2 Nets); Mounted: No; Part Number: Net Tie; Component Type: Net Tie; Pin Count: 2; Family: Net Tie; Socket: No; SMD: No; Sense: No; Status: None; ComponentHeight: 0mm; HelpURL: Undefined; Author: CERN DEM JLC; CreateDate: 22.03.2011; LatestRevisionDate: 22.03.2011; PackageDescription: 2 Plated Through Hole For Coaxial Cable Link: Hole Dia.=1.4mm Pad Dia.=2.5mm
R1#2 R2#2 R3#2 R4#2 = R0805_470R_1%_0.125W_100PPM: Resistor - 1%; Part Description: General Purpose Thick Film Chip Resistor; Manufacturer: GENERIC; Manufacturer1 Part Number: NRC10F4700TRF; Power: 0.125W; TC: ±100ppm/°C; PressFit: No; Part Number: R0805_470R_1%_0.125W_100PPM; Component Kind: Standard; Component Type: Standard; Pin Count: 2; Value: 470; Status: Preferred; Manufacturer Part Number: R0805_470R_1%_0.125W_100PPM; Case: 0805; Mounted: Yes; Sense: No; Socket: No; SMD: Yes; Manufacturer1 Example: NIC COMPONENT; Manufacturer1 ComponentHeight: 0.6mm; HelpURL: \\cern.ch\dfs\Applications\Altium\Datasheets\R0805_NIC_NRC.pdf; Author: CERN DEM JLC; CreateDate: 03.12.2007; LatestRevisionDate: 13.03.2008
R5#2 = R0603_0R_JUMPER: Resistor; Part Description: 1A (0.05R Max DC Resistance) Zero Ohm Jumper; Manufacturer: GENERIC; Manufacturer1 Part Number: NRC06Z0; PressFit: No; Part Number: R0603_0R_JUMPER; Component Kind: Standard; Component Type: Standard; Pin Count: 2; Value: 0; Status: Preferred; Manufacturer Part Number: R0603_0R_JUMPER; Case: 0603; Mounted: Yes; Sense: No; Socket: No; SMD: Yes; Manufacturer1 Example: NIC COMPONENT; Manufacturer1 ComponentHeight: 0.55mm; HelpURL: \\cern.ch\dfs\Applications\Altium\Datasheets\R0603_NIC_NRC.pdf; Author: CERN DEM JLC; CreateDate: 03.12.2007; LatestRevisionDate: 13.03.2008
R38 = R0603_10K_1%_0.1W_100PPM: as R18 on sheet DISP_KEYB; Part Number: R0603_10K_1%_0.1W_100PPM; Component Kind: Standard; Component Type: Standard; Pin Count: 2; Value: 10k; Status: Preferred; Manufacturer Part Number: R0603_10K_1%_0.1W_100PPM; Case: 0603; Mounted: Yes; Sense: No; Socket: No; SMD: Yes; Manufacturer1 Example: NIC COMPONENT; Manufacturer1 ComponentHeight: 0.55mm; HelpURL: \\cern.ch\dfs\Applications\Altium\Datasheets\R0603_NIC_NRC.pdf; Author: CERN DEM JLC; CreateDate: 03.12.2007; LatestRevisionDate: 13.03.2008
R39 = R0603_20K_1%_0.1W_100PPM: Resistor - 1%; Part Description: General Purpose Thick Film Chip Resistor; Manufacturer: GENERIC; Manufacturer1 Part Number: NRC06F2002TRF; Power: 0.1W; TC: ±100ppm/°C; PressFit: No; Part Number: R0603_20K_1%_0.1W_100PPM; Component Kind: Standard; Component Type: Standard; Pin Count: 2; Value: 20k; Status: Preferred; Manufacturer Part Number: R0603_20K_1%_0.1W_100PPM; Case: 0603; Mounted: Yes; Sense: No; Socket: No; SMD: Yes; Manufacturer1 Example: NIC COMPONENT; Manufacturer1 ComponentHeight: 0.55mm; HelpURL: \\cern.ch\dfs\Applications\Altium\Datasheets\R0603_NIC_NRC.pdf; Author: CERN DEM JLC; CreateDate: 03.12.2007; LatestRevisionDate: 13.03.2008
R40 = R0603_47K_1%_0.1W_100PPM: as R37 on sheet DISP_KEYB; Part Number: R0603_47K_1%_0.1W_100PPM; Component Kind: Standard; Component Type: Standard; Pin Count: 2; Value: 47k; Status: Preferred; Manufacturer Part Number: R0603_47K_1%_0.1W_100PPM; Case: 0603; Mounted: Yes; Sense: No; Socket: No; SMD: Yes; Manufacturer1 Example: NIC COMPONENT; Manufacturer1 ComponentHeight: 0.55mm; HelpURL: \\cern.ch\dfs\Applications\Altium\Datasheets\R0603_NIC_NRC.pdf; Author: CERN DEM JLC; CreateDate: 03.12.2007; LatestRevisionDate: 13.03.2008
R41 = R0603_62K_1%_0.1W_100PPM: Resistor - 1%; Part Description: General Purpose Thick Film Chip Resistor; Manufacturer: GENERIC; Manufacturer1 Part Number: NRC06F6202TRF; Power: 0.1W; TC: ±100ppm/°C; PressFit: No; Part Number: R0603_62K_1%_0.1W_100PPM; Component Kind: Standard; Component Type: Standard; Pin Count: 2; Value: 62k; Status: Preferred; Manufacturer Part Number: R0603_62K_1%_0.1W_100PPM; Case: 0603; Mounted: Yes; Sense: No; Socket: No; SMD: Yes; Manufacturer1 Example: NIC COMPONENT; Manufacturer1 ComponentHeight: 0.55mm; HelpURL: \\cern.ch\dfs\Applications\Altium\Datasheets\R0603_NIC_NRC.pdf; Author: CERN DEM JLC; CreateDate: 03.12.2007; LatestRevisionDate: 13.03.2008
R42 = R0603_10M_1%_0.1W_100PPM: Resistor - 1%; Part Description: General Purpose Thick Film Chip Resistor; Manufacturer: GENERIC; Manufacturer1 Part Number: CRCW060310M0FKEA; Power: 0.1W; TC: ±100ppm/°C; PressFit: No; Part Number: R0603_10M_1%_0.1W_100PPM; Component Kind: Standard; Component Type: Standard; Pin Count: 2; Value: 10M; Status: Preferred; Manufacturer Part Number: R0603_10M_1%_0.1W_100PPM; Case: 0603; Mounted: Yes; Sense: No; Socket: No; SMD: Yes; Manufacturer1 Example: VISHAY; Manufacturer1 ComponentHeight: 0.55mm; HelpURL: \\cern.ch\dfs\Applications\Altium\Datasheets\R0603_VISHAY_CRCW e3.pdf; Author: CERN DEM JLC; CreateDate: 12.01.2017; LatestRevisionDate: 12.01.2017
R?#1 = RESISTORPTH-1W: ResistorBasic schematic elements and footprints for 0603, 1206, and PTH resistors.; GateName_1: G$1; DeviceName: PTH-1W; SymbolName_1: RESISTOR; LibraryName: SparkFun-Resistors; DeviceSetName: RESISTOR
R?#2 = B57164: SIEMENS NTC; MPN: B57164K474K52; GateName_1: 1; SymbolName_1: NTC; LibraryName: ptc-ntc; DeviceSetName: B57164; MF: MF; OC_FARNELL: 9753451; OC_NEWARK: 29M3118
R?#3 = VARISTORS05K11: VARISTOR; GateName_1: G$1; SymbolName_1: VARISTOR; DeviceName: S05K11; LibraryName: varistor; DeviceSetName: VARISTOR
RL1 RL6 = REL_COMUS_3563.1231.051: SPDT-CO (1 Form C) Miniature Dual In-line Reed Relay; Part Description: 0.25A/100VDC  SPDT-CO (1 Form C) Miniature Dual In-line Reed Relay; PressFit: No; Value: 5VDC; Part Number: REL_COMUS_3563.1231.051; Component Kind: Standard; Component Type: Standard; Pin Count: 8; PackageDescription: DIP 14, 8 Leads, Row Spacing 7.62 mm, Pitch 2.54 mm, Height 5.82mm; Mounted: Yes; Socket: No; SMD: No; Sense: No; Status: None; Manufacturer: COMUS; Manufacturer Part Number: 3563.1231.051; ComponentHeight: 5.5mm; HelpURL: \\cern.ch\dfs\Applications\Altium\Datasheets\REL_LITTELFUSE_HE721C2400.pdf; Author: GK; CreateDate: 23.01.2018; LatestRevisionDate: 01.02.2018
RN1 = RN_9M_900k_90k_9k_1k_CADDOCK_1776-C6815: Ultra-Precision Voltage Dividers 1776 Series; Power: 31mW; TC: ±5ppm/°C; Tolerance: ±0.1%; Voltage: 1200V; PressFit: No; Part Number: RN_9M_900k_90k_9k_1k_CADDOCK_1776-C6815; Component Kind: Standard; Component Type: Standard; Pin Count: 5; Value: 9M 900K 90K 9K 1K; Status: None; Part Description: Ultra-Precision Voltage Dividers 1776 Series; Manufacturer: CADDOCK; Manufacturer Part Number: 1776-C6815; Mounted: Yes; Socket: No; SMD: No; Sense: No; ComponentHeight: 15.5mm; HelpURL: \\cern.ch\dfs\Applications\Altium\Datasheets\RN_CADDOCK_HVD.pdf; Author: GK; CreateDate: 27.04.2023; LatestRevisionDate: 27.04.2023

## Nets that join several sheets
GND: mV_meter (26 pins), MVM_PSU (20 pins), U_MVM_PSU/U_MVM_BMS (IC23A.2), U_MVM_PSU/U_MVM_BMS (IC23B.2), DISP_KEYB (42 pins), MVM_AFE (5 pins)
GNDi: MVM_PSU (RL2.5 RL3.5), MVM_AFE (34 pins)
P5V0: mV_meter (15 pins), MVM_PSU (C25.2 C26.1 IC6.3), U_MVM_PSU/U_MVM_BMS (IC23A.1), U_MVM_PSU/U_MVM_BMS (IC23B.1), DISP_KEYB (20 pins), MVM_AFE (C13.2 IC16.1 IC16.7)
ADC_CSn: mV_meter (J6.1 R14.1), MVM_AFE (IC16.3)
ADC_SCK: mV_meter (J6.4 R13.1), MVM_AFE (IC16.4)
ADC_SDO: mV_meter (J6.3), MVM_AFE (IC16.6)
B1+: MVM_PSU (BATH1.1 RL2.3 RL4.4), U_MVM_PSU/U_MVM_BMS (R21A.2 R22A.1)
B1-: MVM_PSU (RL2.6 RL4.5), U_MVM_PSU/U_MVM_BMS (Q1A.1_2 Q2A.1 R25A.1)
B1_CHG: mV_meter (J5.11), MVM_PSU (IC10.3)
B1_DISCH: mV_meter (J5.9), MVM_PSU (IC10.1)
B1H: MVM_PSU (BATH2.1 F3.2), U_MVM_PSU/U_MVM_BMS (R24A.1)
B2+: MVM_PSU (BATH5.1 RL3.3 RL5.4), U_MVM_PSU/U_MVM_BMS (R21B.2 R22B.1)
B2-: MVM_PSU (RL3.6 RL5.5), U_MVM_PSU/U_MVM_BMS (Q1B.1_2 Q2B.1 R25B.1)
B2_CHG: mV_meter (J5.12), MVM_PSU (IC10.4)
B2_DISCH: mV_meter (J5.10), MVM_PSU (IC10.2)
B2H: MVM_PSU (BATH6.1 F1.2), U_MVM_PSU/U_MVM_BMS (R24B.1)
BAT+: MVM_PSU (D2.1 D4.1), MVM_AFE (8 pins)
BATLOW: mV_meter (J6.6), MVM_AFE (IC16.5)
CAL_SW: mV_meter (J5.6), DISP_KEYB (C33.2 R18.1)
CHRG_ON: mV_meter (J5.8), MVM_PSU (T1.1)
CHRG_STATn: mV_meter (J6.7), MVM_PSU (T3.3)
NetBATH4_1: MVM_PSU (BATH4.1), U_MVM_PSU/U_MVM_BMS (5 pins)
NetBATH8_1: MVM_PSU (BATH8.1), U_MVM_PSU/U_MVM_BMS (5 pins)
RESETn: mV_meter (J3.1), DISP_KEYB (IC11.18)
RLY_RNG_40_400V: mV_meter (J5.7), MVM_AFE (R4#2.1)
RLY_RNG_400V: mV_meter (J5.5), MVM_AFE (R2#2.1)
SCL: mV_meter (J2#1.1 R7#1.1), DISP_KEYB (IC7.14 IC11.12 IC12.6 IC21.14)
SDA: mV_meter (J2#1.2 R6.1), DISP_KEYB (IC7.15 IC11.13 IC12.5 IC21.15)
USR_SW: mV_meter (J3.2), DISP_KEYB (C53.2 R68.1)
V_BAT_CHG: mV_meter (R10.2), MVM_PSU (5 pins)